# Altium schematic sheet power_supplies.SchDoc
size A
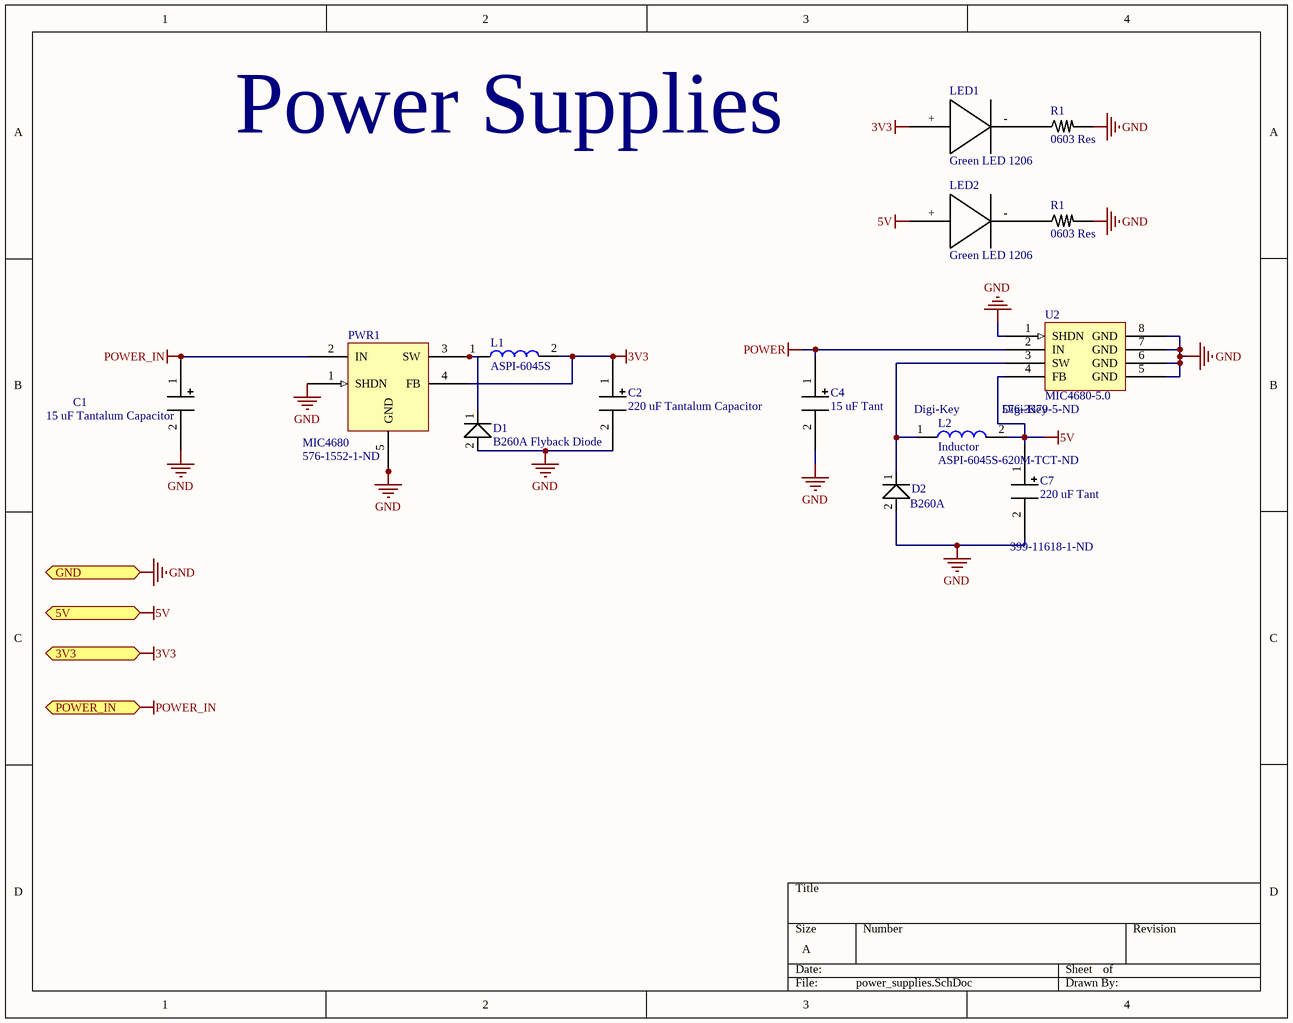
[diagram p0: power_supplies.SchDoc]

## Parts
(Parts that share a designator on the sheet are numbered #1, #2 ... from top to bottom, then left to right.)
C1  15 uF Tantalum Capacitor  [1206 (POLAR)]
C2  220 uF Tantalum Capacitor  [1206 (POLAR)]
C4  15 uF Tant  [1206 (POLAR)]
C7  220 uF Tant  Supplier Part Number 1: 399-11618-1-ND  [2312 Surface Mount (POLAR)]
D1  B260A Flyback Diode  [DO-214AC]
D2  B260A  [DO-214AC]
L1  ASPI-6045S  [ASPI-6045]
L2  Inductor  Supplier 1: Digi-Key  Supplier Part Number 1: ASPI-6045S-620M-TCT-ND  [ASPI-6045]
LED1  Green LED 1206  [Cathode Mark 1206 led footprint]
LED2  Green LED 1206  [Cathode Mark 1206 led footprint]
PWR1  MIC4680  Supplier Part Number 1: 576-1552-1-ND  [TJA1040]
R1#1  0603 Res  [0603/1608 SMD Resistor]
R1#2  0603 Res  [0603/1608 SMD Resistor]
U2  MIC4680-5.0  Supplier 1: Digi-Key  Supplier Part Number 1: 576-3379-5-ND  [SOIC8]

## Ports
3V3 (out), 5V (out), GND, POWER_IN

## Nets
3V3: C2.1 L1.2 LED1.+ PWR1.4(FB) ; port 3V3
5V: C7.1 L2.2 LED2.+ U2.4(FB) ; port 5V
GND: C1.2 C2.2 C4.2 C7.2 D1.2 D2.2 PWR1.1(SHDN) PWR1.5(GND) PWR1.6 PWR1.7 PWR1.8 R1#1.2 R1#2.2 U2.1(SHDN) U2.5(GND) U2.6(GND) U2.7(GND) U2.8(GND) ; port GND
POWER: C4.1 U2.2(IN)
POWER_IN: C1.1 PWR1.2(IN) ; port POWER_IN
NetD1_1: D1.1 L1.1 PWR1.3(SW)
NetD2_1: D2.1 L2.1 U2.3(SW)
NetLED1_-: LED1.- R1#1.1
NetLED2_-: LED2.- R1#2.1

## Notes on the sheet
- Power Supplies

## Library data of the parts
C1 C2 C4 = 15 uF Tantalum Capacitor: 1206 Surface Mount Capacitor
C7 = 220 uF Tantalum Capacitor: 2312 Surface Mount Capacitor; Supplier 1: Digi-Key
D2 = B260A Flyback Diode
L1 = ASPI-6045S: 68 uH 1.2A surface mount inductor
LED1 LED2 = 1206 Green LED: Green surface mount LED
PWR1 = MIC4680: 3.3V Fixed Switching Regulator 1A; Supplier 1: Digi-Key
U2 = MIC4680-5.0: 5V Fixed Switching Regulator 1A
L2 = Inductor: Supplier 2: Digi-Key; Supplier 3: Digi-Key; Supplier Part Number 2: 308-1571-1-ND; Supplier Part Number 3: SRP7030-4R7FMCT-ND